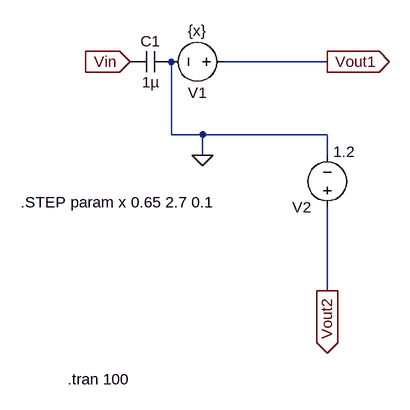
[diagram p0: schematic LM35.asc]
LM35.asc, the LTspice schematic file:
Version 4.1
SHEET 1 2188 688
WIRE 1264 128 1104 128
WIRE 1024 240 1024 128
WIRE 1072 240 1024 240
WIRE 1264 240 1072 240
WIRE 1072 272 1072 240
WIRE 1264 272 1264 240
WIRE 1264 480 1264 352
FLAG 960 128 Vin
IOPIN 960 128 In
FLAG 1264 128 Vout1
IOPIN 1264 128 Out
FLAG 1264 480 Vout2
IOPIN 1264 480 Out
FLAG 1072 272 0
SYMBOL voltage 1120 128 R90
WINDOW 0 32 56 VTop 2
WINDOW 3 -32 56 VBottom 2
WINDOW 123 0 0 Left 0
WINDOW 39 0 0 Left 0
SYMATTR InstName V1
SYMATTR Value {x}
SYMBOL voltage 1264 368 R180
WINDOW 3 -43 102 Left 2
WINDOW 123 0 0 Left 0
WINDOW 39 0 0 Left 0
SYMATTR Value 1.2
SYMATTR InstName V2
SYMBOL cap 1024 112 R90
WINDOW 0 0 32 VBottom 2
WINDOW 3 32 32 VTop 2
SYMATTR InstName C1
SYMATTR Value 1µ
TEXT 864 616 Left 2 !.tran 100
TEXT 792 344 Left 2 !.STEP param x 0.65 2.7 0.1

The netlist it stands for:
* LM35.asc
V1 Vout1 0 {x}
V2 Vout2 0 1.2
C1 0 Vin 1µ
.tran 100
.STEP param x 0.65 2.7 0.1
.backanno
.end